# EAGLE board permamote (EAGLE 8.4.3)
REV: B
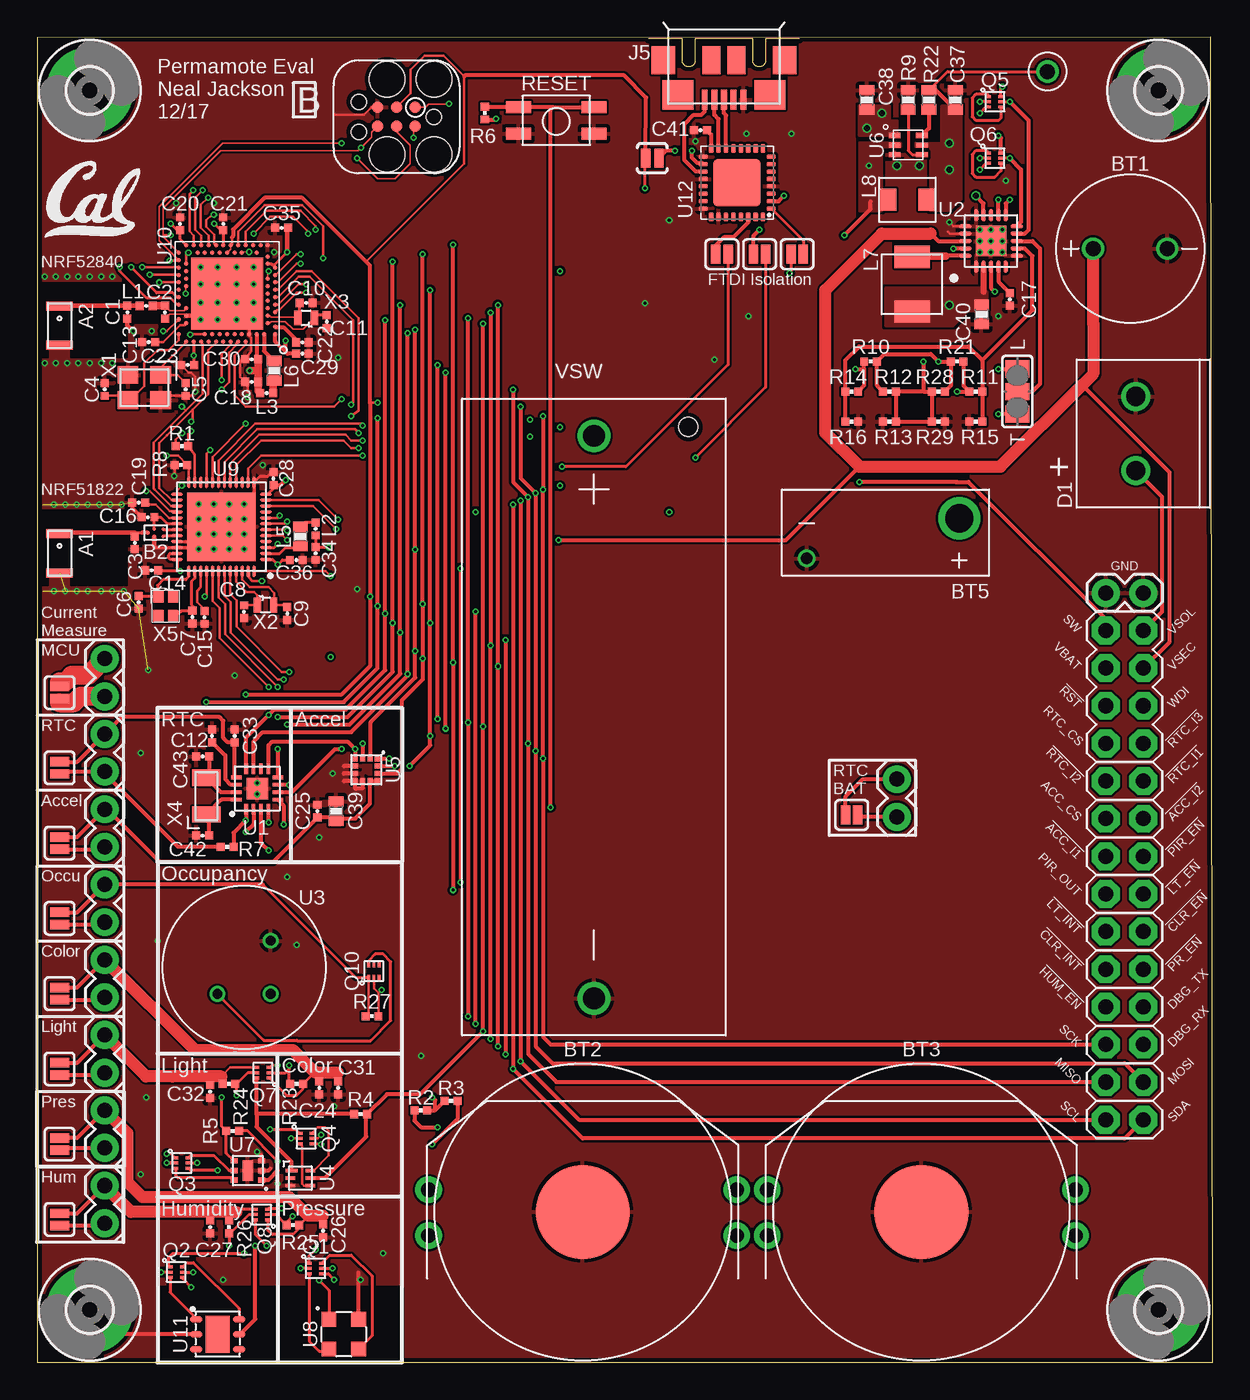
[diagram p5: board, top side]
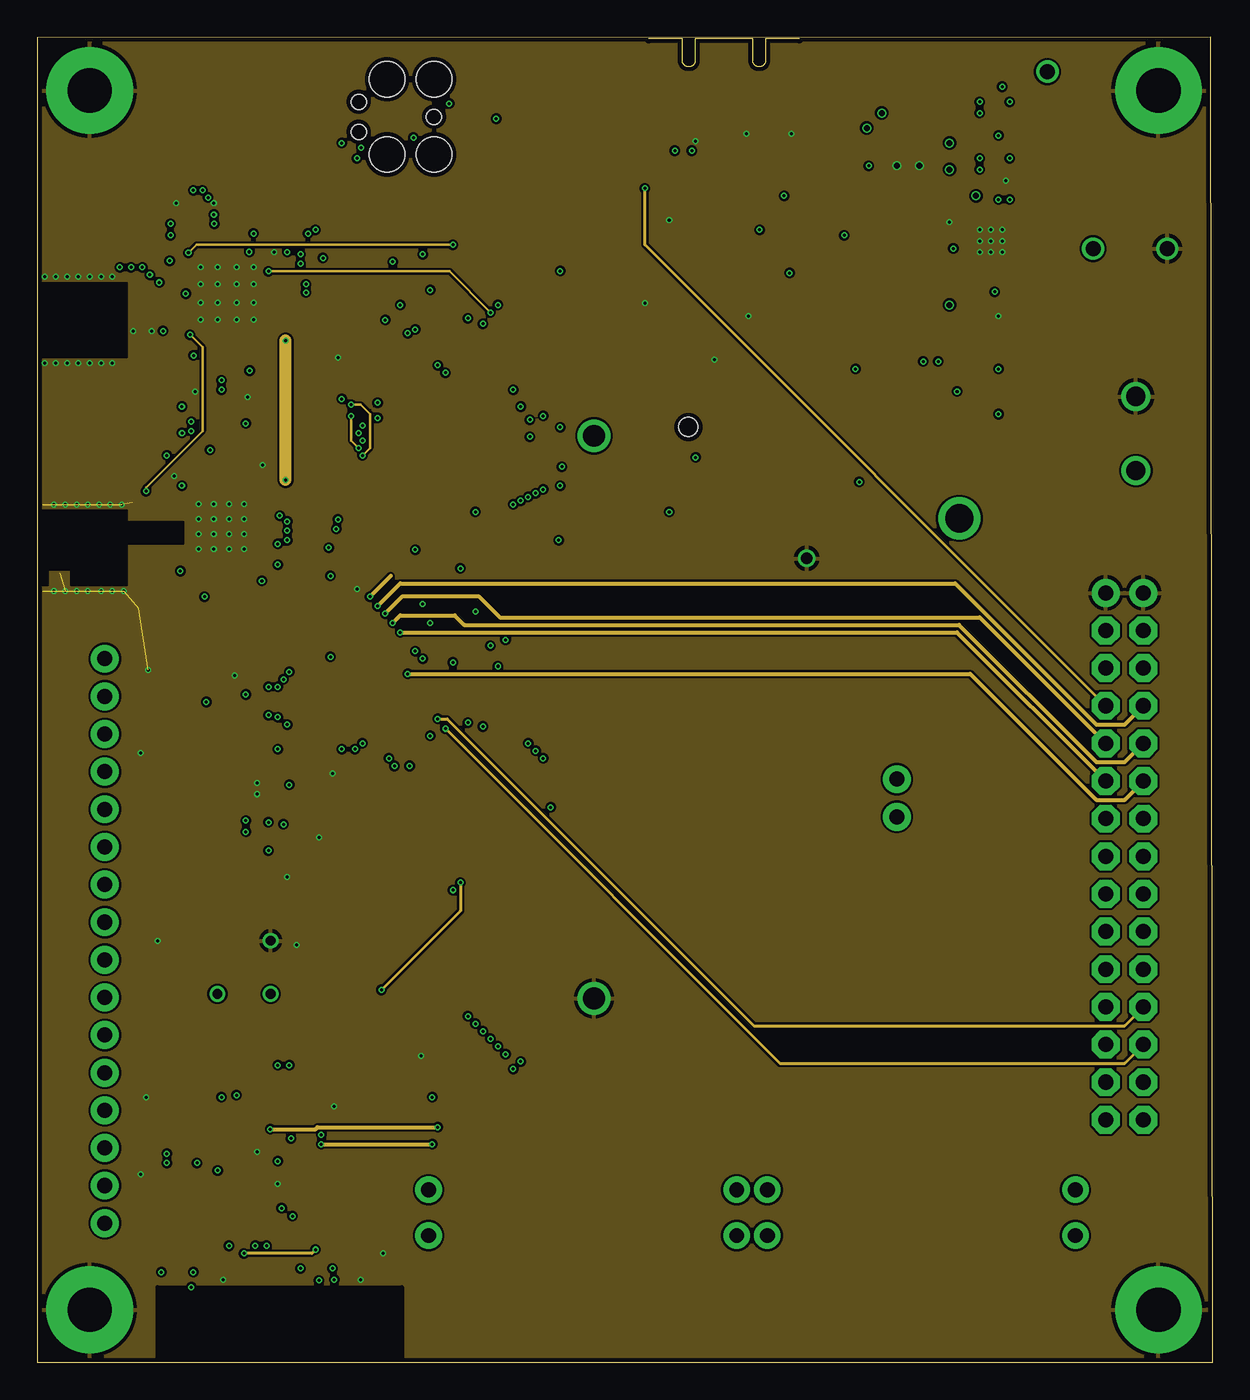
[diagram p6: board, inner layer Route2]
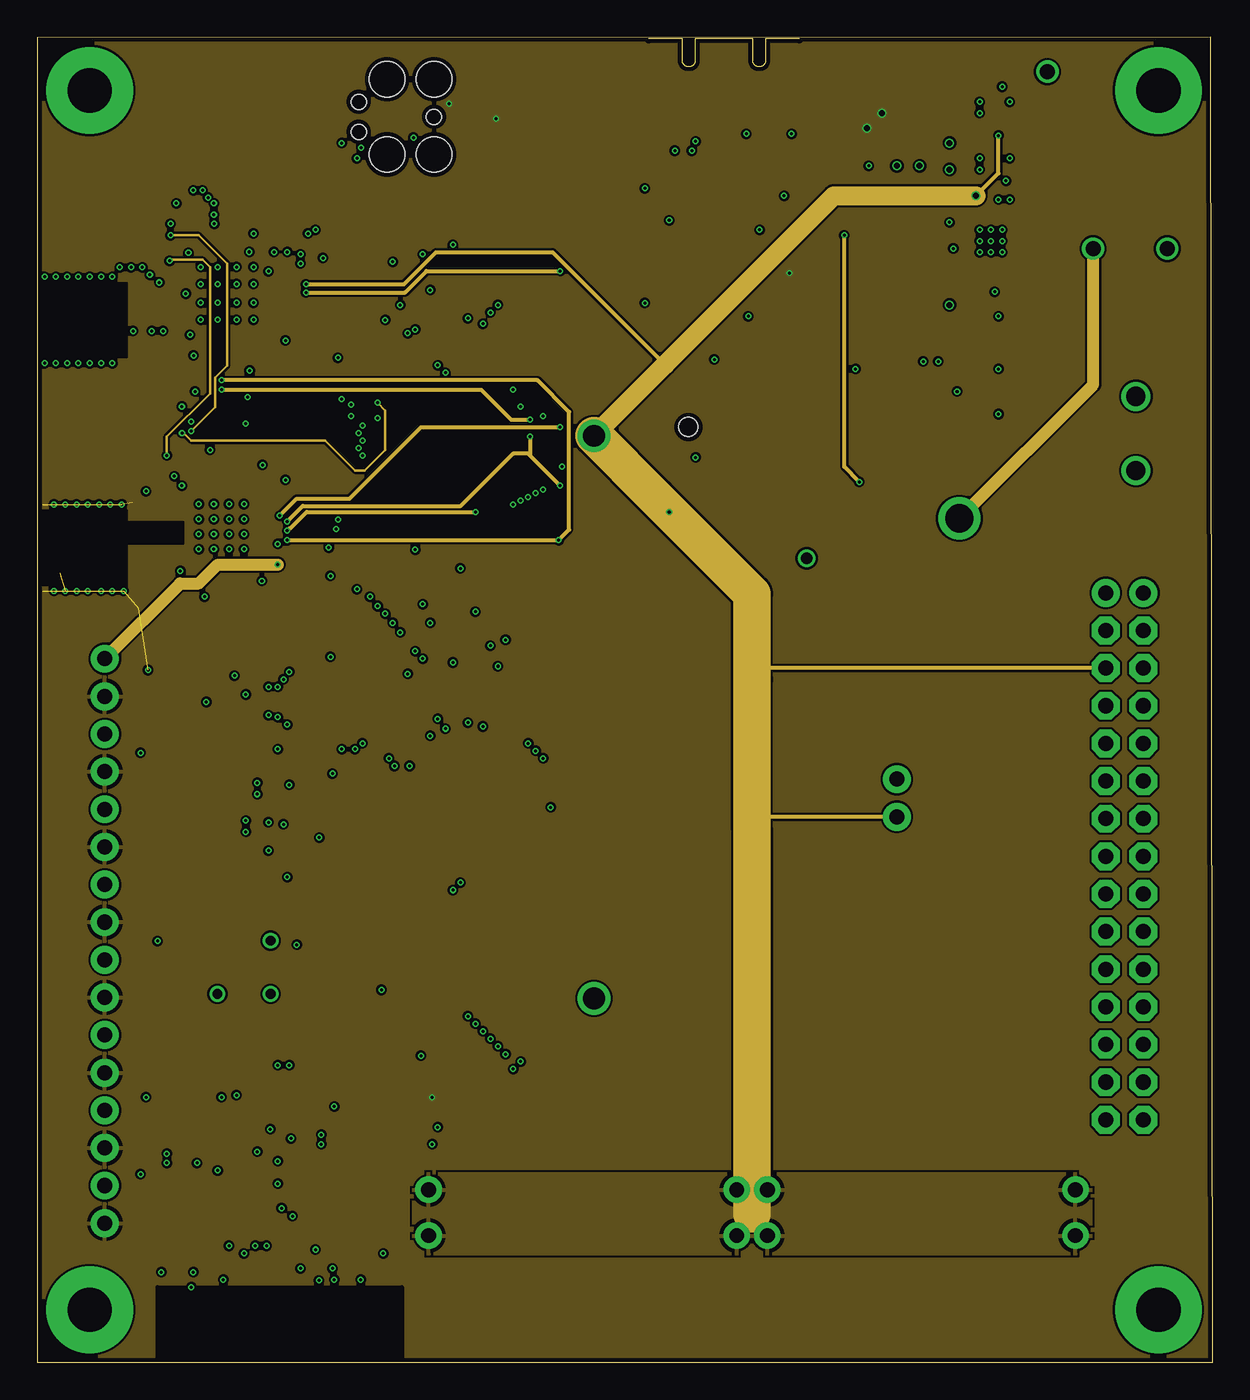
[diagram p7: board, inner layer Route15]
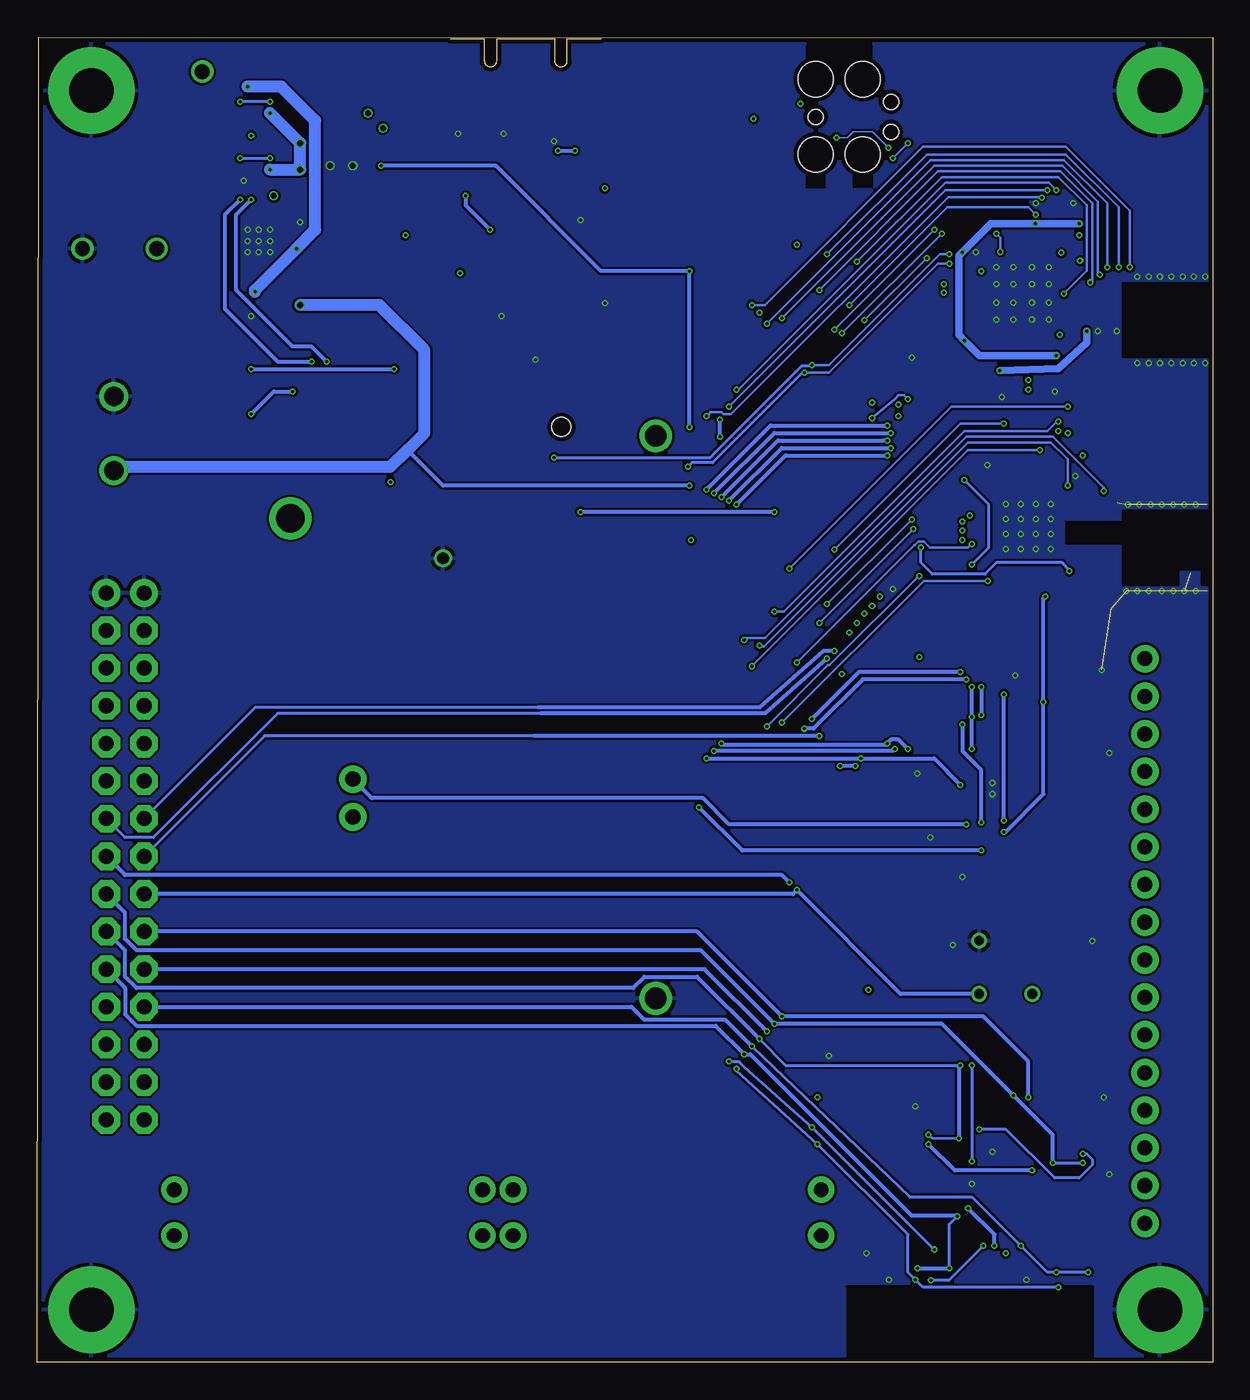
[diagram p8: board, bottom side, seen from below]

Size 79.36 x 89.46 mm. Coordinates in mm from the lower left corner, seen from the top.
Outline: 0,0 79.36,0 79.23,89.46 0,89.41 0,0
Copper layers (1+2*15+16): Top 0.0178mm / dielectric 59mil / Route2 0.0356mm / dielectric 0.1499mm / Route15 0.0356mm / dielectric 0.2007mm / Bottom 0.0178mm
Design rules "quickturn_co_kr_1oz_4lyr *": minimum track width 4mil, minimum drill 8mil, track to track 6mil, track to pad 6mil, pad to pad 6mil, via to via 6mil, smd to smd 6mil, copper to edge 12mil, drill to drill 12mil, minimum pad ring 8mil, minimum via ring 4mil, stop-mask expansion 3mil, vias tented up to drill 50mil, thermal gap 10mil

## Footprints (pad centres in the part's own frame; a part is rotated, then mirrored left to right if it is on the bottom)
ANT3216A063R2400A = smd 0.6 x 1.8: S1 -1.325,0; S2 1.325,0
BAL-NRF01D3 = smd 0.22 x 0.22: ANT1 -0.517,-0.25; ANT2 -0.517,0.25; GND 0.083,0.25; SE 0.516,0; VCC 0.083,-0.25
1020 = drill 1: + -2.5,0; - 2.5,0
BAT-HLD-002-THM = smd 6.35 x 6.35: GND 0,0 | drill 1 pad 1.8: POS1 -10.4,1.5; POS2 -10.4,-1.6; POS3 10.4,1.5; POS4 10.4,-1.6
BH123A = drill 1.47: + 18.985,0; - -18.985,0 | hole 1.27: 19.58,-6.37
VL-2020 = drill 1.9: + -5.1,-1.35 | drill 0.8: - 5.2,1.35
0402_CAP = smd 0.536 x 0.546: 1 -0.433,0; 2 0.433,0
0603_CAP = smd 0.7 x 1: 1 -0.65,0; 2 0.65,0
PHEONIX-1935161 = drill 1.3: 1 0,0; 2 5,0
3,0-PAD = drill 3 pad 5.842: B3,0 0,0
TC2030-IDC = smd 0.787 x 0.787: 1 -1.27,-0.635; 2 -1.27,0.635; 3 0,-0.635; 4 0,0.635; 5 1.27,-0.635; 6 1.27,0.635 | hole 2.375: -2.54,2.54; 0.635,2.54; 0.635,-2.54; -2.54,-2.54 | hole 1.016: -2.54,0; 2.54,1.016; 2.54,-1.016
2X10 = drill 1.016 pad 1.88 octagon: 1 -11.43,-1.27; 2 -11.43,1.27; 3 -8.89,-1.27; 4 -8.89,1.27; 5 -6.35,-1.27; 6 -6.35,1.27; 7 -3.81,-1.27; 8 -3.81,1.27; 9 -1.27,-1.27; 10 -1.27,1.27; 11 1.27,-1.27; 12 1.27,1.27; 13 3.81,-1.27; 14 3.81,1.27; 15 6.35,-1.27; 16 6.35,1.27; 17 8.89,-1.27; 18 8.89,1.27; 19 11.43,-1.27; 20 11.43,1.27
2X4 = drill 1.016 pad 1.88 octagon: 1 -3.81,-1.27; 2 -3.81,1.27; 3 -1.27,-1.27; 4 -1.27,1.27; 5 1.27,-1.27; 6 1.27,1.27; 7 3.81,-1.27; 8 3.81,1.27
1X02 = drill 1.016 pad 1.88: 1 0,0; 2 2.54,0
USB_MICRO_B-HIROSE-ZX62R-B-5P = smd 0.4 x 1.35: 1 1.3,4.125; 2 0.65,4.125; 3 0,4.125; 4 -0.65,4.125; 5 -1.3,4.125 | smd 2.1 x 2: P$1 3.1,3.8; P$2 -3.1,3.8 | smd 1.6 x 1.9: P$3 -4.1,1.45; P$6 4.1,1.45 | smd 1.2 x 1.9: P$4 -0.85,1.45; P$5 0.85,1.45
SJ_2S = smd 0.635 x 1.27: 1 -0.412,0; 2 0.412,0
SJ_2S-NO = smd 0.635 x 1.27: 1 -0.45,0; 2 0.45,0
74437324220 = smd 1.5 x 2.4: P$1 1.85,0; P$2 -1.85,0
IHL-1212BZ-11 = smd 1.2 x 1.5: P$1 -1.35,0; P$2 1.35,0
XDFN-6 = smd 0.35 x 0.2: 1 -0.425,0.35; 2 -0.425,0; 3 -0.425,-0.35; 4 0.425,-0.35; 5 0.425,0; 6 0.425,0.35
0402_RES = smd 0.536 x 0.546: 1 -0.433,0; 2 0.433,0
0603-RES = smd 0.7 x 1: 1 -0.65,0; 2 0.65,0
EVQP2 = smd 1.676 x 0.813: P$1 -2.54,-0.87; P$2 -2.54,0.908; P$3 2.54,-0.87; P$4 2.54,0.908
SJ_2 = smd 1.168 x 1.6: 1 -1.524,0; 2 0,0; 3 1.524,0
TESTPOINT_0.040IN = drill 1.016: TESTPOINT 0,0
QFN-16-3MM = smd 0.7 x 0.25: 1 -1.4,0.75; 2 -1.4,0.25; 3 -1.4,-0.25; 4 -1.4,-0.75; 9 1.35,-0.75; 10 1.35,-0.25; 11 1.35,0.25; 12 1.35,0.75 | smd 0.25 x 0.7: 5 -0.75,-1.4; 6 -0.25,-1.4; 7 0.25,-1.4; 8 0.75,-1.4; 13 0.75,1.4; 14 0.25,1.4; 15 -0.25,1.4; 16 -0.75,1.4 | smd 1.45 x 1.45: GND 0,0
S-PVQFN-N20-RGR = smd 0.28 x 0.85: 1 -1,-1.74; 2 -0.5,-1.74; 3 0,-1.74; 4 0.5,-1.74; 5 1,-1.74; 11 1,1.74; 12 0.5,1.74; 13 0,1.74; 14 -0.5,1.74; 15 -1,1.74 | smd 0.85 x 0.28: 6 1.74,-1; 7 1.74,-0.5; 8 1.74,0; 9 1.74,0.5; 10 1.74,1; 16 -1.74,1; 17 -1.74,0.5; 18 -1.74,0; 19 -1.74,-0.5; 20 -1.74,-1 | smd 2.05 x 2.05: PAD 0,0
AMN2 = drill 0.65: GND 1.796,-1.796; OUT -1.796,-1.796; VCC -1.796,1.796
ODFN-6-1.5MMX1.6MM = smd 0.8 x 0.25: 1 -0.6,0.5 | smd 0.65 x 0.25: 2 -0.675,0; 3 -0.675,-0.5; 4 0.675,-0.5; 5 0.675,0; 6 0.675,0.5
LGA-12 = smd 0.375 x 0.35: 1 -0.75,0.75; 2 -0.75,0.25; 3 -0.75,-0.25; 4 -0.75,-0.75; 7 0.75,-0.75; 8 0.75,-0.25; 9 0.75,0.25; 10 0.75,0.75 | smd 0.35 x 0.375: 5 -0.25,-0.75; 6 0.25,-0.75; 11 0.25,0.75; 12 -0.25,0.75
UDFN-6-MAXIM = smd 0.8 x 0.35: 1 -0.915,0.65; 2 -0.915,0; 3 -0.915,-0.65; 4 0.915,-0.65; 5 0.915,0; 6 0.915,0.65
UDFN-6-EXPOSED = smd 0.48 x 0.36: 1 -0.925,0.65; 2 -0.925,0; 3 -0.925,-0.65; 4 0.925,-0.65; 5 0.925,0; 6 0.925,0.65 | smd 0.71 x 1.4: EP 0,0
4-SMD = smd 1 x 1: 1 -1,1; 2 -1,-1; 3 1,-1; 4 1,1
QFN-48-6MM = smd 0.8 x 0.203: 1 -3,2.2; 2 -3,1.8; 3 -3,1.4; 4 -3,1; 5 -3,0.6; 6 -3,0.2; 7 -3,-0.2; 8 -3,-0.6; 9 -3,-1; 10 -3,-1.4; 11 -3,-1.8; 12 -3,-2.2; 25 3,-2.2; 26 3,-1.8; 27 3,-1.4; 28 3,-1; 29 3,-0.6; 30 3,-0.2; 31 3,0.2; 32 3,0.6; 33 3,1; 34 3,1.4; 35 3,1.8; 36 3,2.2 | smd 0.203 x 0.8: 13 -2.2,-3; 14 -1.8,-3; 15 -1.4,-3; 16 -1,-3; 17 -0.6,-3; 18 -0.2,-3; 19 0.2,-3; 20 0.6,-3; 21 1,-3; 22 1.4,-3; 23 1.8,-3; 24 2.2,-3; 37 2.2,3; 38 1.8,3; 39 1.4,3; 40 1,3; 41 0.6,3; 42 0.2,3; 43 -0.2,3; 44 -0.6,3; 45 -1,3; 46 -1.4,3; 47 -1.8,3; 48 -2.2,3 | smd 4.6 x 4.6: GND 0,0
AQFN73 = smd 0.3 x 0.3: A8 -1.25,3.25; A10 -0.75,3.25; A12 -0.25,3.25; A14 0.25,3.25; A16 0.75,3.25; A18 1.25,3.25; A20 1.75,3.25; A22 2.25,3.25; A23 2.75,3.25; AA24 3.25,-2.25; AB2 -2.75,-2.5; AC5 -2,-2.75; AC9 -1,-2.75; AC11 -0.5,-2.75; AC13 0,-2.75; AC15 0.5,-2.75; AC17 1,-2.75; AC19 1.5,-2.75; AC21 2,-2.75; AC24 3.25,-2.75; AD2 -2.75,-3.25; AD4 -2.25,-3.25; AD6 -1.75,-3.25; AD8 -1.25,-3.25; AD10 -0.75,-3.25; AD12 -0.25,-3.25; AD14 0.25,-3.25; AD16 0.75,-3.25; AD18 1.25,-3.25; AD20 1.75,-3.25; AD22 2.25,-3.25; AD23 2.75,-3.25; B1 -3.25,2.75; B3 -2.5,2.75; B5 -2,2.75; B7 -1.5,2.75; B9 -1,2.75; B11 -0.5,2.75; B13 0,2.75; B15 0.5,2.75; B17 1,2.75; B19 1.5,2.75; B24 3.25,2.75; C1 -3.25,2.25; D2 -2.75,2; D23 2.75,2; E24 3.25,1.75; F2 -2.75,1.5; F23 2.75,1.5; G1 -3.25,1.25; H2 -2.75,1; H23 2.75,1; J1 -3.25,0.75; J24 3.25,0.75; K2 -2.75,0.5; L1 -3.25,0.25; L24 3.25,0.25; M2 -2.75,0; N1 -3.25,-0.25; N24 3.25,-0.25; P2 -2.75,-0.5; P23 2.75,-0.5; R1 -3.25,-0.75; R24 3.25,-0.75; T2 -2.75,-1; T23 2.75,-1; U1 -3.25,-1.25; U24 3.25,-1.25; V23 2.75,-1.5; W1 -3.25,-1.75; W24 3.25,-1.75; Y2 -2.75,-2; Y23 2.75,-2 | smd 4.85 x 4.85: GND 0,0
DFN-6/3MM = smd 0.85 x 0.45: 1 -1.45,1; 2 -1.45,0; 3 -1.45,-1; 4 1.45,-1; 5 1.45,0; 6 1.45,1 | smd 1.6 x 2.5: P$1 0,0
QFN32 = smd 0.6 x 0.3: 1 -2.3,1.75; 2 -2.3,1.25; 3 -2.3,0.75; 4 -2.3,0.25; 5 -2.3,-0.25; 6 -2.3,-0.75; 7 -2.3,-1.25; 8 -2.3,-1.75; 17 2.3,-1.75; 18 2.3,-1.25; 19 2.3,-0.75; 20 2.3,-0.25; 21 2.3,0.25; 22 2.3,0.75; 23 2.3,1.25; 24 2.3,1.75 | smd 0.3 x 0.6: 9 -1.75,-2.3; 10 -1.25,-2.3; 11 -0.75,-2.3; 12 -0.25,-2.3; 13 0.25,-2.3; 14 0.75,-2.3; 15 1.25,-2.3; 16 1.75,-2.3; 25 1.75,2.3; 26 1.25,2.3; 27 0.75,2.3; 28 0.25,2.3; 29 -0.25,2.3; 30 -0.75,2.3; 31 -1.25,2.3; 32 -1.75,2.3 | smd 3.2 x 3.2: EXP 0,0
TXC-7V = smd 1.4 x 1.2: 1 -1.1,-0.85; 2 1.1,-0.85; 3 1.1,0.85; 4 -1.1,0.85
ABS05 = smd 0.5 x 1: A -0.55,0; B 0.55,0
2-SMD = smd 1.092 x 1.905: 1 -1.245,0; 2 1.245,0
TXC-8Y = smd 0.8 x 0.7: 1 -0.65,-0.5; 2 0.65,-0.5; 3 0.65,0.5; 4 -0.65,0.5

## Placement (x,y rotation side)
A1  ANT3216A063R2400A  [ANT3216A063R2400A]  1.52,54.61 270 top
A2  ANT3216A063R2400A  [ANT3216A063R2400A]  1.52,69.98 270 top
B2  BAL-NRF01D3  [BAL-NRF01D3]  8,56.01 180 top
BT1  LTOHTC1020  [1020]  73.79,75.18 0 top
BT2  BAT-HLD-002-THM  [BAT-HLD-002-THM]  36.83,10.16 0 top
BT3  BAT-HLD-002-THM  [BAT-HLD-002-THM]  59.69,10.16 0 top
BT4  BAT_PACKCR123A  [BH123A]  37.59,43.56 90 top
BT5  VL-2020  [VL-2020]  57.15,55.63 180 top
C1  0.5pF  [0402_CAP]  6.1,70.88 270 top
C2  0.8pF  [0402_CAP]  8.64,70.88 270 top
C3  0.8pF  [0402_CAP]  6.6,55.32 270 top
C4  12pF  [0402_CAP]  4.57,65.67 270 top
C5  12pF  [0402_CAP]  10.03,65.67 90 top
C6  12pF  [0402_CAP]  6.86,51.31 270 top
C7  12pF  [0402_CAP]  10.49,50.32 270 top
C8  12pF  [0402_CAP]  13.97,50.67 270 top
C9  12pF  [0402_CAP]  16.89,50.55 270 top
C10  12pF  [0402_CAP]  18.16,71.52 180 top
C11  12pF  [0402_CAP]  19.56,70.25 90 top
C12  47pF  [0402_CAP]  11.81,42.29 90 top
C13  100pF  [0402_CAP]  7.54,68.86 180 top
C14  1nF  [0402_CAP]  7.75,53.47 180 top
C15  1nF  [0402_CAP]  11.3,50.29 270 top
C16  2.2nF  [0402_CAP]  7.49,57.05 180 top
C17  10nF  [0402_CAP]  65.66,71.75 270 top
C18  47nF  [0402_CAP]  14.48,66.18 180 top
C19  47nF  [0402_CAP]  6.86,58.04 180 top
C20  0.1uF  [0402_CAP]  9.65,76.85 90 top
C21  0.1uF  [0402_CAP]  12.57,76.85 90 top
C22  0.1uF  [0402_CAP]  17.91,68.85 0 top
C23  0.1uF  [0402_CAP]  10.16,67.33 180 top
C24  0.1uF  [0402_CAP]  19.05,18.54 270 top
C25  0.1uF  [0402_CAP]  18.92,37.21 90 top
C26  0.1uF  [0402_CAP]  19.3,8.89 270 top
C27  0.1uF  [0402_CAP]  11.68,9.14 270 top
C28  0.1uF  [0402_CAP]  15.96,59.66 90 top
C29  1uF  [0402_CAP]  17.91,68.09 0 top
C30  1uF  [0402_CAP]  14.48,67.71 180 top
C31  1uF  [0402_CAP]  20.32,18.54 270 top
C32  1uF  [0402_CAP]  11.68,18.29 270 top
C33  1uF  [0402_CAP]  13.34,42.29 90 top
C34  1uF  [0402_CAP]  18.8,54.61 270 top
C35  4.7uF  [0402_CAP]  16.51,76.58 180 top
C36  4.7uF  [0402_CAP]  17.5,54.17 0 top
C37  10uF  [0603_CAP]  61.98,85.22 90 top
C38  10uF  [0603_CAP]  56.01,85.22 90 top
C39  10uF  [0603_CAP]  20.19,37.21 90 top
C40  4.7uF  [0603_CAP]  63.75,70.74 270 top
C41  0.1uF  [0402_CAP]  44.78,83.17 180 top
C42  DNP  [0402_CAP]  11.18,35.56 180 top
C43  DNP  [0402_CAP]  11.18,40.89 180 top
D1  SOLARCELLSCREW  [PHEONIX-1935161]  74.17,60.2 90 top
H1  MOUNT-PAD-ROUND3.0  [3,0-PAD]  75.69,3.56 0 top
H2  MOUNT-PAD-ROUND3.0  [3,0-PAD]  3.56,85.85 0 top
H3  MOUNT-PAD-ROUND3.0  [3,0-PAD]  75.69,85.85 0 top
H4  MOUNT-PAD-ROUND3.0  [3,0-PAD]  3.56,3.56 0 top
J1  TC2030-JLINK-L  [TC2030-IDC]  24.26,84.07 180 top
J2  M10X2  [2X10]  73.41,27.81 90 top
J3  M04X2  [2X4]  73.41,45.59 90 top
J4  [1X02]  72.14,51.94 0 top
J5  MICRO_USB_B_HIROSE_ZX62R-B-5P  [USB_MICRO_B-HIROSE-ZX62R-B-5P]  46.37,89.34 180 top
JP1  [SJ_2S]  1.52,35.05 270 top
JP2  [SJ_2S]  1.52,24.89 270 top
JP3  [SJ_2S]  1.52,19.81 270 top
JP4  [SJ_2S]  1.52,14.73 270 top
JP5  [SJ_2S]  1.52,9.65 270 top
JP6  [SJ_2S]  1.52,40.13 270 top
JP7  [SJ_2S]  1.52,45.21 270 top
JP8  [SJ_2S]  1.52,29.97 270 top
JP9  [1X02]  4.57,47.5 270 top
JP10  [1X02]  4.57,42.42 270 top
JP11  [1X02]  4.57,37.34 270 top
JP12  [1X02]  4.57,27.18 270 top
JP13  [1X02]  4.57,22.1 270 top
JP14  [1X02]  4.57,32.26 270 top
JP15  [1X02]  4.57,17.02 270 top
JP16  [1X02]  4.57,11.94 270 top
JP17  [SJ_2S-NO]  41.53,81.28 180 top
JP18  [SJ_2S]  54.99,36.96 0 top
JP19  [1X02]  58.04,39.37 270 top
JP20  [SJ_2S]  46.23,74.8 0 top
JP21  [SJ_2S]  48.77,74.8 0 top
JP22  [SJ_2S]  51.31,74.8 0 top
L1  3.3nH  [0402_CAP]  7.37,71.31 0 top
L2  15nH  [0402_CAP]  18.8,56.26 90 top
L3  15nH  [0402_CAP]  15.49,65.42 0 top
L5  10uH  [0603_CAP]  17.78,55.75 270 top
L6  10uH  [0603_CAP]  16,66.94 90 top
L7  22uH  [74437324220]  59.05,72.77 90 top
L8  1uH  [IHL-1212BZ-11]  58.75,78.47 180 top
Q1  PMDXB950UPEL  [XDFN-6]  18.8,6.35 0 top
Q2  PMDXB950UPEL  [XDFN-6]  9.4,6.1 0 top
Q3  PMDXB950UPEL  [XDFN-6]  9.78,13.46 0 top
Q4  PMDXB950UPEL  [XDFN-6]  18.16,15.11 0 top
Q5  PMDXB950UPEL  [XDFN-6]  64.64,85.09 0 top
Q6  PMDXB950UPEL  [XDFN-6]  64.64,81.28 0 top
Q7  PMDXB950UPEL  [XDFN-6]  15.24,19.56 180 top
Q8  PMDXB950UPEL  [XDFN-6]  15.16,9.99 180 top
Q10  PMDXB950UPEL  [XDFN-6]  22.73,26.41 90 top
R1  150Ω  [0402_RES]  9.78,61.85 0 top
R2  10kΩ  [0402_RES]  25.91,17.02 0 top
R3  10kΩ  [0402_RES]  27.94,17.65 180 top
R4  10kΩ  [0402_RES]  21.84,16.76 180 top
R5  10kΩ  [0402_RES]  13.21,15.62 0 top
R6  10kΩ  [0402_RES]  30.23,84.33 270 top
R7  10kΩ  [0402_RES]  12.83,34.8 180 top
R8  12kΩ  [0402_RES]  9.72,60.58 180 top
R9  80.6kΩ  [0603-RES]  58.8,85.22 270 top
R10  6.04k  [0402_RES]  56.26,67.56 180 top
R11  3.9M  [0402_RES]  63.37,65.53 180 top
R12  8.87M  [0402_RES]  57.53,65.53 180 top
R13  4.22M  [0402_RES]  57.53,63.5 0 top
R14  7.32M  [0402_RES]  54.99,65.53 0 top
R15  9.09M  [0402_RES]  63.37,63.5 0 top
R16  5.62M  [0402_RES]  54.99,63.5 180 top
R21  6.04k  [0402_RES]  62.1,67.56 0 top
R22  33MΩ  [0603-RES]  60.2,85.22 90 top
R23  100MΩ  [0402_RES]  17.53,18.8 0 top
R24  100MΩ  [0402_RES]  12.95,18.8 180 top
R25  100MΩ  [0402_RES]  17.27,9.27 0 top
R26  100MΩ  [0402_RES]  12.95,9.14 90 top
R27  100MΩ  [0402_RES]  22.61,23.37 180 top
R28  6.19M  [0402_RES]  60.83,65.53 0 top
R29  6.81M  [0402_RES]  60.83,63.5 180 top
S1  EVQP2  [EVQP2]  35.05,83.82 0 top
SJ1  [SJ_2]  66.17,65.53 270 top
TP10  TEST_POINT_0.040IN  [TESTPOINT_0.040IN]  68.2,87.12 180 top
U1  AB1815-T3  [QFN-16-3MM]  14.86,38.73 90 top
U2  BQ25505  [S-PVQFN-N20-RGR]  64.39,75.69 0 top
U3  EKMB1101111  [AMN2]  13.97,26.67 90 top
U4  ISL29125  [ODFN-6-1.5MMX1.6MM]  17.78,12.45 0 top
U5  LIS2DW12  [LGA-12]  22.23,40.01 270 top
U6  MAX17222  [UDFN-6-MAXIM]  58.8,82.17 0 top
U7  MAX44009  [UDFN-6-EXPOSED]  14.22,12.95 180 top
U8  MS5637-02BA03  [4-SMD]  20.7,1.91 0 top
U9  NRF51822QF  [QFN-48-6MM]  12.45,56.41 180 top
U10  NRF52840  [AQFN73]  12.83,72.15 180 top
U11  SI7021-A20-GM1  [DFN-6/3MM]  12.19,1.91 0 top
U12  FT232RQ  [QFN32]  47.26,79.63 180 top
U$1  [UCB_CAL_200MIL]  0.51,75.95 0 top
X1  32MHz  [TXC-7V]  7.24,65.8 180 top
X2  ABS05-32.768KHZ-9-T  [ABS05]  15.42,51.13 0 top
X3  32.768kHz  [ABS05]  18.16,70.5 180 top
X4  ABS07-32.768KHZ-7-T  [2-SMD]  11.43,38.23 90 top
X5  16MHz  [TXC-8Y]  8.69,51.03 270 top

## Tracks (layer width: path | path; a pad name or v marks a point on that pad's centre or on a via)
3V3OUT
  Top 0.254: C41.1 45.51,82.87 U12.16
!CLR_EN  (via drill 0.2)
  Top 0.102: U10.T2 15.58,73.62 v15.62,73.65
  Top 0.152: v9.78,59.18 9.45,58.85 U9.25 | Q4.5 18.92,15.11 v19.18,15.37 | Q4.2 v17.14,15.11
  Top 0.203: Q7.2 16.76,19.56 17.02,19.81 v17.02,20.07 17.02,18.87 R23.1
  Top 0.254: v30.61,21.84 v30.61,48.39 v30.61,70.87
  Route2 0.152: v30.61,70.87 27.85,73.65 v15.62,73.65
  Bottom 0.152: v9.78,59.18 9.78,60.96 10.92,62.1 16.51,62.1 30.29,48.32 30.54,48.32 v30.61,48.39 | v19.18,15.37 18.92,15.11 v17.14,15.11
  Bottom 0.203: v17.02,20.07 28.83,20.07 v30.61,21.84
  Bottom 0.254: v17.02,20.07 17.14,19.94 v17.14,15.11 | J2.11 73.41,27.81 73.41,26.04 72.64,25.27 39.12,25.27 38.35,26.04 34.8,26.04 v30.61,21.84
!CLR_INT  (via drill 0.2)
  Top 0.152: U10.W24 9.55,73.93 9.53,73.91 v7.11,73.91 | v19.81,53.09 19.49,53.41 U9.48
  Top 0.254: v30.1,70.1 v30.1,42.93 v30.1,22.35 25.86,18.11 23.62,18.11 R4.1 22.23,16.71 22.23,15.24 19.43,12.45 U4.5
  Bottom 0.152: v7.11,73.91 7.11,78.23 10.03,81.15 19.05,81.15 v30.1,70.1 | v30.1,42.93 25.96,47.07 25.86,47.07 19.84,53.09 v19.81,53.09
  Bottom 0.254: v30.1,22.35 34.29,26.54 J2.10
!HUM_EN  (via drill 0.2)
  Top 0.152: U9.21 11.45,61.36 v11.68,61.59
  Top 0.203: Q2.5 v10.54,6.1 | Q2.2 v8.38,6.1 | Q8.5 14.31,9.99 13.03,8.71 R26.1 v12.95,7.87 | U10.J24 9.45,71.4 9.01,71.84 7.41,71.84 5.59,73.66 v5.59,73.91
  Top 0.254: v31.11,21.34 v31.11,46.99 v31.11,71.37
  Bottom 0.152: v11.68,61.59 16.51,61.59 v31.11,46.99 | v5.59,73.91 5.59,77.72 9.91,82.04 19.56,82.04 29.78,71.82 | 29.78,71.82 30.1,71.5 | v31.11,71.37 30.23,71.37 29.78,71.82
  Bottom 0.203: v8.38,6.1 v10.54,6.1 11.18,6.1 v12.95,7.87 16.26,11.18 20.45,11.18 v31.11,21.34
  Bottom 0.254: J2.8 39.24,24 38.38,23.14 32.92,23.14 v31.11,21.34
!LT_EN  (via drill 0.2)
  Top 0.152: U9.26 9.08,58.21 8.26,59.03 8.26,62.05 8.76,62.56 | 10.5,64.3 8.76,62.56 | 10.5,64.3 11.56,65.36 11.56,68.33 12.08,68.85 U10.A16 | 10.5,64.3 10.5,63.59 v10.41,63.5 | 8.79,62.59 8.76,62.56 | 8.76,62.56
  Top 0.203: Q3.5 v10.79,13.46 | 9.07,13.46 v8.76,13.46 Q3.2 | Q7.5 14.22,19.56 13.46,18.8 | 13.46,18.8 R24.1 | v13.46,18.03 13.46,18.8
  Top 0.254: v29.59,22.86 v29.59,50.67
  Bottom 0.152: v10.41,63.5 10.49,63.42 10.59,63.42 11.15,62.87 16.76,62.87 28.96,50.67 v29.59,50.67
  Bottom 0.203: v10.79,13.46 v8.76,13.46
  Bottom 0.254: v10.79,13.46 10.79,15.37 v13.46,18.03 18.29,22.86 v29.59,22.86 34.54,27.81 72.64,27.81 73.41,28.57 73.41,30.35 J2.13
!LT_INT  (via drill 0.2)
  Top 0.152: U10.U24 9.56,73.42 9.54,73.41 v7.62,73.41 | U9.47 14.32,53.34 14.32,52.97 14.53,52.76 v15.18,52.76
  Top 0.203: U7.4 12.78,14.13 R5.1 12.45,15.95 v12.45,17.91
  Top 0.254: v29.08,23.37 v29.08,43.18 v29.08,70.48
  Bottom 0.152: v15.18,52.76 19.51,52.76 v29.08,43.18 | v7.62,73.41 7.75,73.53 7.75,78.36 10.16,80.77 18.8,80.77 v29.08,70.48 29.08,70.36
  Bottom 0.254: J2.12 34.8,29.08 v29.08,23.37 15.49,23.37 12.45,20.32 v12.45,17.91
!PIR_EN  (via drill 0.2)
  Top 0.152: U10.A20 11.08,68.82 11.18,68.72 11.18,65.41 10.03,64.26 | v9.78,64.52 10.03,64.26 | 10.03,64.26 7.87,62.1 7.87,58.98 7.95,58.9 9.04,57.81 U9.27 | 23.04,24.94 R27.1 | 23.04,24.94 v23.24,25.15 | Q10.2 22.73,25.25 23.04,24.94
  Top 0.254: v28.57,53.59 v28.57,32.38
  Route2 0.203: v28.57,32.38 28.57,30.48 v23.24,25.15
  Bottom 0.152: v28.57,53.59 17.65,64.52 v9.78,64.52
  Bottom 0.254: v28.57,32.38 29.08,32.89 73.41,32.89 J2.15
!PR_EN  (via drill 0.2)
  Top 0.152: U9.28 9.38,57.48 8.94,57.48 7.62,58.8 v7.37,58.8 | U10.B19 10.35,69.4 v10.32,69.37
  Top 0.203: Q1.5 v19.94,6.35 | Q1.2 v17.78,6.35 | Q8.2 16.12,9.99 16.74,9.37 | 16.74,9.37 R25.1 | v17.24,9.88 16.74,9.37
  Top 0.254: v31.62,48.77 v31.62,20.8
  Route2 0.152: v10.32,69.37 11.18,68.52 11.18,62.87 7.37,59.05 v7.37,58.8
  Bottom 0.152: v7.37,58.8 7.37,59.05 10.79,62.48 16.64,62.48 30.23,48.9 31.5,48.9 v31.62,48.77
  Bottom 0.203: v17.78,6.35 17.78,9.34 v17.24,9.88
  Bottom 0.254: v19.94,6.35 v17.78,6.35 | J2.9 73.41,25.27 73.41,23.5 72.64,22.73 33.55,22.73 v31.62,20.8 31.22,20.8 20.32,9.91 17.27,9.91 v17.24,9.88
!RST  (via drill 0.2)
  Top 0.102: U10.AC13 13.08,75.15 U10.AD12
  Top 0.152: R1.1 9.35,62.3 v9.78,62.74 | U10.AD12 13.16,75.48 13.16,75.95 | v22.99,64.77 22.48,64.77 | J1.3 25.23,85.68 25.23,87.26 26.15,88.18 27.45,88.18 28.83,86.8 28.83,80.9 22.23,74.3
  Top 0.203: v41.02,79.25 41.02,81.18 JP17.2
  Top 0.254: v14.1,45.09 20.57,45.09 22.48,46.99 v22.48,51.69 22.48,64.77 22.48,74.04 22.23,74.3 17.91,78.61 15.37,78.61 13.23,76.47 13.23,76.02 13.16,75.95 | R7.1 13.26,35.74 v14.1,36.58 v14.11,36.59 U1.1 | JP17.2 41.12,85.38 39.62,86.87 28.9,86.87 28.83,86.8
  Route2 0.203: v41.02,79.25 41.02,75.44 J3.4
  Route2 0.254: v22.48,51.69 23.88,53.09
  Route15 0.152: v9.78,62.74 9.91,62.74 10.41,62.23 19.43,62.23 21.46,60.2 22.1,60.2 23.5,61.59 23.5,64.26 v22.99,64.77
  Bottom 0.254: v14.1,36.58 v14.1,45.09
!RTC_EXTR  (via drill 0.2)
  Top 0.254: 34.8,84.73 S1.P$4 | 34.8,84.73 S1.P$2 32.48,84.76 R6.1 | U1.3 15.11,35.06 v15.62,34.54 | v34.67,37.47 34.67,84.6 34.8,84.73
  Bottom 0.254: v34.67,37.47 31.75,34.54 v15.62,34.54
!RTC_IRQ1  (via drill 0.2)
  Top 0.102: U10.AC9 13.88,74.96 v14.32,74.96
  Top 0.152: v18.29,76.2 18.29,76.33 17.27,77.34 15.75,77.34 v14.61,76.2
  Top 0.254: U1.11 14.61,41.91 15.24,42.55 21.21,42.55 25.02,46.35 v25.02,46.48 v25.02,69.47
  Route2 0.254: J2.19 73.41,37.97 71.5,37.97 62.99,46.48 v25.02,46.48
  Bottom 0.152: v18.29,76.2 v25.02,69.47 | v14.32,74.96 14.32,75.92 v14.61,76.2
!RTC_IRQ2  (via drill 0.2)
  Top 0.152: U10.AD16 11.96,75.52 11.96,76.12 11.43,76.65 11.43,77.09 11.81,77.47 v11.94,77.47
  Top 0.254: U1.4 v15.61,36.46 v15.62,36.45 | v16.89,43.05 21.08,43.05 24.51,46.48 v24.51,49.28 v24.51,71.37
  Route2 0.254: J2.20 62.1,49.28 v24.51,49.28
  Bottom 0.152: v11.94,77.47 12.45,77.98 17.91,77.98 v24.51,71.37
  Bottom 0.254: v15.62,36.45 15.62,40.01 16.89,41.27 v16.89,43.05
!RTC_IRQ3  (via drill 0.2)
  Top 0.102: U10.P23 10.05,72.62 v10.05,72.14
  Top 0.152: U9.42 12.25,51.63 12.7,51.18 12.7,49.15 v16.26,45.59
  Top 0.254: U1.8 16.26,41.27 v16.26,41.4 | v24,74.3 v24,49.91 24,46.61 20.95,43.56 v16.26,43.56
  Route2 0.254: v24,49.91 24.51,50.42 28.19,50.42 28.83,49.78 62.23,49.78 71.5,40.51 73.41,40.51 J3.1
  Bottom 0.152: v24,74.3 18.29,80.01 10.41,80.01 8.51,78.11 8.51,73.68 v10.05,72.14
  Bottom 0.254: v16.26,41.4 v16.26,43.56 v16.26,45.59
!VBAT_PRI_ON  (via drill 0.2)
  Top 0.203: v65.66,81.28 Q6.5 | Q6.2 v63.63,81.28
  Top 0.254: v65.66,81.28 66.42,80.52 66.42,76.98 U2.10
  Bottom 0.203: v65.66,81.28 v63.63,81.28
!VBAT_SEC_ON  (via drill 0.2)
  Top 0.203: Q5.2 v63.63,85.09 | Q5.5 v65.66,85.09
  Top 0.254: v65.66,85.09 66.93,83.82 66.93,76.45 66.67,76.19 U2.9
  Bottom 0.203: v63.63,85.09 v65.66,85.09
ACC_CS  (via drill 0.2)
  Top 0.152: U9.20 11.85,61.12 v14.1,63.37 | v18.8,76.45 18.8,76.71 17.78,77.72 15.49,77.72 14.08,76.31 U10.AD8
  Top 0.254: U5.2 22.52,40.8 22.52,43.22 25.53,46.23 v25.53,48.01 v25.53,54.86 v25.53,69.72
  Bottom 0.152: v14.1,63.37 17.02,63.37 v25.53,54.86 | v18.8,76.45 v25.53,69.72
  Bottom 0.203: 45.51,44.22 64.62,44.22 J2.18
  Bottom 0.254: v25.53,48.01 26.29,48.01 30.58,44.22 45.51,44.22
ACC_INT1  (via drill 0.2)
  Top 0.152: 9.56,72.91 U10.R24 8.51,72.9 v8.26,72.9 | U9.10 18.65,57.81 v20.19,56.26
  Top 0.254: v26.54,72.39 v26.54,49.91 v26.54,42.29 26.54,41.66 v25.15,40.26 | U5.12 v24.13,40.26
  Bottom 0.152: v20.19,56.26 v26.54,49.91 | v8.26,72.9 8.13,73.03 8.13,78.23 10.29,80.39 18.54,80.39 v26.54,72.39
  Bottom 0.203: 45.79,42.29 64.01,42.29 J2.16
  Bottom 0.254: v24.13,40.26 v25.15,40.26 | v26.54,42.29 45.79,42.29
ACC_INT2  (via drill 0.2)
  Top 0.152: U10.L24 | U9.11 19.01,58.21 v20.32,56.9
  Top 0.203: U10.L24 9.45,71.9 9.16,72.2 8.07,72.2 v6.35,73.91
  Top 0.254: U5.11 23.75,39.76 23.75,39.75 24.3,39.75 24.64,40.08 24.64,44.7 26.04,46.1 v26.04,47.5 v26.04,51.18 v26.04,74.8
  Bottom 0.152: v20.32,56.9 v26.04,51.18 | v6.35,73.91 6.35,77.98 9.91,81.53 19.3,81.53 v26.04,74.8
  Bottom 0.203: 45.34,43.81 63.12,43.81 71.5,35.43 73.41,35.43 J2.17
  Bottom 0.254: v26.04,47.5 30.23,43.81 45.34,43.81
AVDD1  (via drill 0.2)
  Top 0.203: U9.35 8.96,54.61 8.89,54.51 8.89,54.3 8.99,54.21 U9.36 9.45,53.65 v9.68,53.42 8.23,53.42 C14.1 | L2.1 C34.1 19.63,55.04 v19.68,54.99
  Bottom 0.203: v9.68,53.42 10.16,53.98 14.61,53.98 15.37,53.21 18.92,53.21 19.68,53.98 v19.68,54.99
D+
  Top 0.254: U12.14 46.51,84.18 46.35,84.33 46.35,85.21 J5.3
D-
  Top 0.254: U12.15 46.01,83.92 45.72,84.2 J5.2
DBG_RX  (via drill 0.2)
  Top 0.152: U10.R1 16.26,72.9 17.53,74.17 v17.78,74.17 | U9.43 12.65,51.74 13.08,51.31 13.08,49.28 16.26,46.1 v16.64,46.1
  Top 0.203: v35.43,60.45 39.75,60.45 46.64,67.34 JP20.2
  Top 0.254: v27.56,42.77 v27.56,66.8 | 46.55,74.71 JP20.2
  Route2 0.203: v27.56,42.77 50.14,20.19 73.41,20.19 J2.5
  Bottom 0.152: v17.78,74.17 18.54,74.17 25.91,66.8 v27.56,66.8
  Bottom 0.203: v27.56,66.8 27.69,66.8 33.76,60.73 35.15,60.73 v35.43,60.45
  Bottom 0.254: v16.64,46.1 23.62,46.1 26.95,42.77 v27.56,42.77
DBG_TX  (via drill 0.2)
  Top 0.152: v17.78,74.8 17.51,74.8 16.11,73.4 U10.U1 | U9.44 13.05,51.85 13.46,51.44 13.46,49.66 16.51,46.61 v17.02,46.61
  Top 0.203: JP21.2 49.18,65.82 v44.45,61.09
  Top 0.254: v27.05,43.43 v27.05,67.31
  Route2 0.203: v27.05,43.43 27.69,43.43 48.39,22.73 73.41,22.73 J2.7
  Bottom 0.152: v17.78,74.8 18.41,74.8 25.91,67.31 v27.05,67.31
  Bottom 0.203: v27.05,67.31 27.1,67.26 27.75,67.26 33.74,61.27 33.74,61.26 33.91,61.09 v44.45,61.09
  Bottom 0.254: v17.02,46.61 23.88,46.61 v27.05,43.43
DCC1
  Top 0.203: U9.2 16.38,54.61 16.76,54.99 17.41,54.99 L5.2
GND  (via drill 0.2, 0.41)  (20 unrouted)
  Top 0.102: 9.43,70.75 | 9.43,70.75 9.97,70.75 U10.F23 | C2.2 8.94,70.75 9.43,70.75
  Top 0.152: U10.B7 14.33,69.31 14.46,69.19 14.46,68.25 C30.2 13.72,67.63 13.72,66.51 C18.2 14.22,66 14.22,65.53 | 11.05,70.88 v11.05,71.52 11.68,72.15 U10.GND | C23.2 10.23,66.82 10.39,66.82 10.67,66.55 v10.67,65.53 10.38,65.24 C5.1 8.88,65.24 | 9.28,60.7 R8.2 9.28,59.95 v9.27,59.82 | J1.5 22.59,84.71 22.09,84.2 20.07,84.2 | U2.16 61.87,76.69 v61.59,76.96 | U2.17 61.6,76.19 61.47,76.33
  Top 0.203: U10.B7 14.33,70.65 U10.GND | C28.2 15.93,60.17 15.54,59.79 15.03,59.79 U9.13 14.65,58.74 v13.97,57.94 | U9.33 10.28,55.41 v10.92,54.89 10.68,55.01 U9.34 9.43,54.99 8,54.99 7.92,55.07 | v13.97,55.91 v13.97,54.89 | U9.GND v12.95,55.91 | 5.21,1.91 H4.B3,0
  Top 0.254: U11.2 5.21,1.91 | U8.4 21.7,6.06 | U5.6 20.7,39.76 20.7,39.75 | 20.7,39.24 21.46,39.24 U5.7 21.48,38.73 21.54,38.73 21.56,38.75 21.98,38.75 U5.8 | U5.5 20.7,40.26 | C19.2 6.42,57.68 C16.2 | U7.2 15.62,12.95 15.75,13.08 | U7.3 15.15,13.93 v14.86,14.22
  Top 0.305: B2.GND 7.92,55.07 | U10.F23 10.61,70.65 10.84,70.88 11.05,70.88 | 6.1,69.98 C1.2 6.1,69.99 v6.48,69.61
  other vias: 59.56,80.77 11.94,55.91 11.94,56.92 11.94,57.94 11.94,54.89 10.92,55.91 10.92,56.92 10.92,57.94 12.95,57.94 12.95,56.92 12.95,54.89 13.97,56.92 15.21,60.58 14.61,73.93 14.61,72.79 14.61,71.52 14.61,70.37 7.75,69.61 13.46,73.93 13.46,72.79 13.46,71.52 13.46,70.37 12.19,73.93 12.19,72.79 12.19,71.52 12.19,70.37 11.05,73.93 11.05,72.79 11.05,70.37 12.57,5.59 21.84,5.59 25.91,20.7 20.07,17.27 6.99,41.15 21.59,52.2 13.34,46.35 8.13,28.45 17.53,28.19 6.99,12.7 11.94,78.23 9.4,78.23 16,74.95 14.86,39.12 14.86,38.35 16.89,32.77 19.05,35.43 14.22,65.15 20.32,67.82 19.94,39.75 7.37,17.91 64.9,70.61 58.04,80.77 65.41,79.76 63.63,76.45 63.63,75.69 63.63,74.93 64.39,74.93 64.39,75.69 64.39,76.45 65.15,76.45 65.15,75.69 65.15,74.93 23.37,7.37 16.26,12.06 44.45,82.42 41.02,71.5 42.67,77.09 45.72,67.69 48.01,70.61 50.93,82.93 47.88,82.93 5.08,73.28 4.32,73.28 3.56,73.28 2.79,73.28 2.03,73.28 1.27,73.28 0.51,73.28 5.08,67.44 4.32,67.44 3.56,67.44 2.79,67.44 2.03,67.44 1.27,67.44 0.51,67.44 7.49,46.74 5.84,52.07 5.08,52.07 4.32,52.07 3.43,52.07 2.67,52.07 1.91,52.07 1.14,52.07 5.71,57.91 4.95,57.91 4.19,57.91 3.43,57.91 2.67,57.91 1.91,57.91 1.14,57.91
  pour Top (rank 2): 0,89.41 79.25,89.41 79.25,0 0,0
  pour Bottom (rank 2): 0,89.41 79.25,89.41 79.25,0 0,0
  pour Top (rank 2, no thermals): 0.76,68.83 2.29,68.83 2.29,67.56 0.76,67.56
  pour Top (rank 2, no thermals): 0.76,52.2 0.76,53.47 2.29,53.47 2.29,52.2
  pour Route2 (rank 2): 0,89.41 0,0 79.25,0 79.25,89.41
MISO  (via drill 0.2)
  Top 0.152: U10.AD22 10.58,76.05 10.29,76.34 10.29,78.87 v10.54,79.12 | U9.17 13.05,60.67 14.99,62.61 20.83,62.61 21.21,62.23 v21.97,62.23
  Top 0.254: U1.6 16.28,38.51 17.22,38.51 20.11,41.4 v20.57,41.4 | v32.13,65.66 32.13,59.44 v33.15,58.42 v33.15,41.78 33.15,20.83 35.05,18.92 J2.4 | v21.97,41.78 v21.98,41.78 U5.3
  Bottom 0.152: v10.54,79.12 11.05,79.63 18.03,79.63 32,65.66 v32.13,65.66 | 22.23,62.23 v21.97,62.23
  Bottom 0.254: v33.15,41.78 33.05,41.68 22.07,41.68 v21.97,41.78 21.72,42.04 21.21,42.04 v20.57,41.4 | 22,62.23 22.23,62.23 29.34,62.23 v33.15,58.42
MOSI  (via drill 0.2)
  Top 0.152: U10.AD20 11.08,76.06 10.67,76.47 10.67,78.61 v11.18,79.12 | U9.18 12.65,60.78 14.86,62.99 21.46,62.99 v21.72,62.74
  Top 0.254: U1.9 15.62,40.1 15.62,41.66 15.88,41.91 20.95,41.91 v21.46,41.4 21.48,41.39 U5.4 | v32.64,64.52 32.64,59.69 v33.66,58.67 v33.66,41.27 33.66,21.34 34.8,20.19 73.41,20.19 J2.3
  Bottom 0.152: v32.64,64.52 18.03,79.12 v11.18,79.12
  Bottom 0.254: v33.66,41.27 21.59,41.27 v21.46,41.4 | v21.72,62.74 29.59,62.74 v33.66,58.67
N$1  (via drill 0.2)
  Top 0.254: R21.2 62.54,65.94 R11.2 v62.1,65.53 | SJ1.3 v64.9,64.01
  Bottom 0.254: v64.9,64.01 63.37,65.53 v62.1,65.53
N$2
  Top 0.254: U10.C1 16.11,69.87 16.64,69.87 17.47,69.03 C22.1
N$3  (via drill 0.2)
  Top 0.152: U10.E24 9.55,70.4 8.76,69.61 v8.51,69.61
  Top 0.254: U10.B5 14.83,67.88 C30.1 | 14.91,65.57 L3.1
  Top 0.508: 14.91,66.94 C30.1 | 14.91,66.94 C18.1 14.91,65.57 | v14.35,66.94 14.91,66.94
  Bottom 0.508: v8.51,69.61 8.51,68.85 10.41,67.07 v14.35,66.94
N$4
  Top 0.152: C13.1 8.51,68.86 9.66,70.02 9.95,70.02 U10.D23
N$5
  Top 0.102: 10.11,71.14 U10.H23 9.93,71.01 9.32,71.01 | 9.32,71.01 | C2.1 8.94,71.01 9.32,71.01
  Top 0.508: C2.1 7.98,71.31 L1.2
N$6
  Top 0.305: 6.31,71.31 7.06,71.31 L1.1 | 6.31,71.31 C1.1 1.54,71.31 A2.S1 | 6.31,71.31
N$7
  cutout Route2: 0,67.82 6.1,67.82 6.1,72.9 0,72.9
N$8
  Top 0.152: C4.2 6.23,65.24 X1.3 6.35,65.02 | 6.35,65.02 6.39,65.03 | 6.35,65.02 7.24,65.9 7.24,67.44 8.13,68.33 8.89,68.33 9.58,69.01 U10.B24
N$9
  Top 0.152: C5.2 9.49,66.65 X1.1 8.38,66.69 8.38,67.18 10.08,68.88 U10.A23
N$10
  cutout Top: 62.87,76.71 62.87,76.45 62.48,76.45 62.48,76.71
N$11
  cutout Top: 15.24,13.46 14.99,13.46 14.99,13.21 15.24,13.21
N$12
  Top 0.203: R9.2 58.8,81.79 59.07,81.52 U6.4
N$13
  Top 0.203: U12.1 51.72,75.72 JP22.2
N$14
  Top 0.254: R22.1 60.2,83.3 U6.6
N$15
  Top 0.254: U5.10 U5.9 22.48,37.72 21.47,36.71 20.34,36.71 C39.1 19.98,36.78 C25.1 15.93,33.78 8.28,33.78 4.65,37.41 JP11.1 2.7,35.46 JP1.1
N$16  (via drill 0.2)
  Top 0.254: 55.83,67.06 R10.2 | 55.83,67.06 55.83,65.94 R14.2 | v64.9,67.06 SJ1.1 | v55.24,67.06 55.83,67.06
  Bottom 0.254: v64.9,67.06 v55.24,67.06
N$17
  cutout Top: 21.72,40.13 21.72,39.88 21.34,39.88 21.34,40.13
N$18
  Top 0.254: R15.2 R11.1 63.81,67.64 | R16.2 R14.1 54.56,67.64 55.5,68.58 62.87,68.58 63.81,67.64 | 63.81,67.64 67.18,71.02 67.18,74.68 66.67,75.19 U2.7
N$19
  Top 0.152: Q8.1
  Top 0.203: 17.7,9.07 R25.2 | C26.1 19.3,9.91 | 18.29,9.91 18.29,9.85 R25.2 | R25.2 17.7,9.07 | 17.7,9.07 17.27,8.64 15.88,8.64 15.58,8.93 Q8.1
  Top 0.254: JP15.1 2.7,15.14 JP4.1
  Top 0.813: 19.3,9.91 18.29,9.91 17.02,11.18 7.11,11.18 6.1,12.19 6.1,15.49 JP15.1
N$21  (via drill 0.2)
  Top 0.152: Q8.6
  Top 0.203: v15.49,7.87 14.73,8.64 Q8.6 | v19.02,5.54 19.7,4.87 U8.1
  Bottom 0.203: v15.49,7.87 17.82,5.54 v19.02,5.54
N$22  (via drill 0.2)
  Top 0.203: Q8.3 15.66,10.41 v16.51,10.41
  Top 0.254: U11.5 13.72,1.91 14.73,2.92 v14.73,7.87
  Bottom 0.254: v14.73,7.87 14.73,8.64 v16.51,10.41
N$23
  Top 0.203: U3.VCC 15.31,21.74 17.55,21.74 17.57,21.72 22.51,21.72 23.88,23.08 23.88,27.05 23.37,27.56 22.83,27.56 22.38,27.11 Q10.6
N$24
  Top 0.152: Q10.1 22.39,23.58 R27.2
  Top 0.203: Q10.1 21.52,25.98 15.24,32.26
  Top 0.254: JP8.1 2.7,30.38 JP14.1 15.24,32.26
N$25
  Top 0.254: U1.14 13.09,38.98 12.7,39.37 12.7,40.97 C12.1
N$26
  Top 0.254: U1.16 12.43,37.98 11.54,37.1 | 11.54,37.1 X4.1 | C42.1 11.61,37.03 11.54,37.1
N$27
  Top 0.254: U1.15 12.42,38.48 X4.2 11.61,39.65 C43.1
N$29  (via drill 0.2)
  other vias: 19.81,47.62
N$30
  Top 0.254: U2.4 64.89,72.96 C17.1
N$31
  Top 0.152: Q7.6 14.81,19.18
  Top 0.254: U4.1 17.18,13.55 14.81,15.92 14.81,16.76 | 14.81,16.76 14.81,19.18 | R4.2 14.81,16.76
N$32
  Top 0.254: SJ1.2 67.18,65.53 67.69,66.04 67.69,75.18 67.18,75.69 U2.8
N$33
  Top 0.203: Q7.1 16.84,18.03 17.53,18.03 17.96,18.47 R23.2 18.67,19.51 18.67,19.68 | C24.1 19.3,19.23 19.3,19.56 | C31.1 20.32,19.56
  Top 0.254: JP2.1 2.7,25.3 JP12.1
  Top 0.813: JP12.1 10.67,21.08 17.27,21.08 18.67,19.68 18.8,19.56 19.3,19.56 20.32,19.56
N$34
  Top 0.203: Q1.6 19.76,7.24 21.21,7.24 22.61,5.84 22.61,1.81 U8.3
N$35
  cutout Route15: 0,67.82 6.1,67.82 6.1,72.9 0,72.9
N$36
  Top 0.203: 13.13,10.34 13.46,10.16 13.65,10.34 Q8.4
  Top 0.254: JP5.1 2.7,10.06 JP16.1 | C27.1 11.68,10.16 | R26.2 12.95,10.16
  Top 0.813: JP16.1 6.35,10.16 11.68,10.16 12.95,10.16 13.46,10.16
N$37
  Top 0.152: Q7.4 13.05,19.91 12.45,19.3
  Top 0.254: JP3.1 2.7,20.22 JP13.1 | R24.2 12.45,18.87 12.45,19.3 | C32.1 11.68,19.3
  Top 0.813: 12.45,19.3 11.68,19.3 9.14,19.3 7.37,19.3 JP13.1
N$38
  cutout Top: 0,72.9 6.1,72.9 6.1,71.63 10.29,71.63 10.29,70.61 9.91,70.63 9.14,70.61 9.01,70.52 9.01,70.15 6.1,70.1 6.1,67.82 2.29,67.82 2.29,68.83 0.76,68.83 0.76,67.82 0,67.82
  cutout Top: 0,57.53 6.1,57.53 6.1,56.77 9.91,56.77 9.91,55.24 6.1,55.24 6.1,52.45 2.29,52.45 2.29,53.47 0.76,53.47 0.76,52.45 0,52.45
  cutout Bottom: 0,57.53 6.1,57.53 6.1,56.77 9.91,56.77 9.91,55.24 6.1,55.24 6.1,52.45 2.29,52.45 2.29,53.47 0.76,53.47 0.76,52.45 0,52.45
  cutout Route2: 0,57.53 6.1,57.53 6.1,56.77 9.91,56.77 9.91,55.24 6.1,55.24 6.1,52.45 2.29,52.45 2.29,53.47 0.76,53.47 0.76,52.45 0,52.45
  cutout Route15: 0,57.53 6.1,57.53 6.1,56.77 9.91,56.77 9.91,55.24 6.1,55.24 6.1,52.45 2.29,52.45 2.29,53.47 0.76,53.47 0.76,52.45 0,52.45
N$39
  cutout Bottom: 0,67.82 6.1,67.82 6.1,72.9 0,72.9
N$40
  Top 0.254: U2.20 61.36,74.69 61.34,74.68
  Top 0.508: 61.34,74.68 59.11,74.68 L7.P$1
N$41
  Top 0.203: Q1.3 18.37,1.44 19.05,0.76 19.56,0.76 U8.2
N$42
  Top 0.254: JP6.1 2.7,40.54 JP10.1 5.71,43.56 12.32,43.56 12.57,43.31 12.57,42.16 12.88,41.86 C33.1 13.34,39.61 U1.13
N$43
  cutout Top: 8.13,0 8.13,5.08 24.64,5.08 24.64,0
  cutout Bottom: 8.13,0 8.13,5.08 24.64,5.08 24.64,0
  cutout Route2: 8.13,0 8.13,5.08 24.64,5.08 24.64,0
  cutout Route15: 8.13,0 8.13,5.08 24.64,5.08 24.64,0
N$44
  Top 0.254: U10.B3 15.33,68.27 L6.2
N$45
  Top 0.203: Q5.1 64.22,85.52 64.14,85.6 63.37,85.6 63.12,85.34 63.12,84.07 63.37,83.82 64.9,83.82 65.07,83.99 Q5.4
N$46  (via drill 0.2)
  Top 0.254: U12.18 44.88,80.95 44.57,80.95 44.2,81.32 v44.2,81.79 | v43.05,81.79 42.45,81.79 JP17.1
  Bottom 0.254: v44.2,81.79 v43.05,81.79
N$47  (via drill 0.2)
  Top 0.203: Q5.6 65.07,86.02 v65.15,86.11
  Top 0.254: U2.3 64.39,72.52 v64.64,72.26 | U2.19 61.86,75.19 v61.85,75.18
  Bottom 0.61: 61.85,75.06 v61.85,75.18
  Bottom 0.813: v65.15,86.11 62.87,86.11 60.58,83.82 60.58,76.45 v61.85,75.18 64.64,72.39 v64.64,72.26
N$48
  Top 0.203: U11.1 10.74,2.97 8.97,4.74 Q2.3
N$49
  Top 0.254: 15.93,66.22 L6.1
  Top 0.508: L3.2 15.93,66.22
N$50
  Top 0.203: Q2.6 10.11,6.73 10.55,6.73 13.64,3.64 U11.6
N$51
  Top 0.152: Q3.3
  Top 0.203: Q3.3 9.35,12.62 9.53,12.45 13.16,12.45 U7.6
N$52
  Top 0.203: Q3.6 10.36,13.97 11.94,13.97 12.95,12.95 U7.5
N$53
  Top 0.203: Q6.4 65.07,80.44 64.64,80.01 63.37,80.01 63.12,80.26 63.12,81.53 63.37,81.79 64.06,81.79 Q6.1
N$54
  Top 0.152: Q4.3 17.9,14.6 17.9,12.07 18.03,11.94 18.45,11.94 U4.4
N$55
  Top 0.152: Q4.6 18.59,15.54 18.92,15.88 19.43,15.88 19.68,15.62 19.68,13.97 18.66,12.95 U4.6
N$56  (via drill 0.2)
  Top 0.254: JP18.1 54.58,38.2 55.75,39.37 JP19.1 | U1.5 16.64,37.61 v16.64,36.32
  Bottom 0.254: 57.53,38.86 JP19.1 56.77,38.1 34.42,38.1 32.64,36.32 v16.64,36.32
N$57  (via drill 0.2)
  Top 0.254: 59.82,65.53 R28.1 R29.2 R13.2 R12.1 59.82,65.53 | U2.12 64.89,78.48 v64.9,78.49 | v59.82,67.56 59.82,65.53
  Bottom 0.254: v64.9,78.49 65.91,77.47 65.91,72.39 62.1,68.58 60.83,68.58 v59.82,67.56
N$58  (via drill 0.2)
  Top 0.254: R28.2 61.67,65.94 R21.1 v60.83,67.56 60.33,68.07 57.2,68.07 R10.1 56.69,65.94 R12.2 | v65.66,78.49 65.39,78.22 U2.11
  Bottom 0.254: v60.83,67.56 63.12,67.56 66.67,71.12 66.67,77.47 v65.66,78.49
N$59  (via drill 0.2)
  Top 0.152: v16.26,20.07 15.82,20.07 Q7.3
  Top 0.203: U7.1 15.1,12.3 | v16.26,13.59 14.22,15.62 R5.2
  Top 0.254: U7.1 15.61,12.3 16.26,12.95 v16.26,13.59
  Bottom 0.203: v16.26,20.07 v16.26,13.59
N$60
  Top 0.203: B2.ANT1 8.54,56.21 U9.31
N$61
  Top 0.203: B2.ANT2 8.54,55.81 U9.32
N$62
  Top 0.152: C3.1 6.6,56 6.6,56.01
  Top 0.203: 7.07,56.01 6.6,56.01
  Top 0.254: B2.SE 7.07,56.01
  Top 0.305: A1.S1 1.6,56.01 6.6,56.01
N$63
  Top 0.203: L2.2 18.07,56.69 L5.1
N$64
  Top 0.203: U9.37 10.25,53.05 10.03,52.83 8.51,52.83 8.13,52.45 8.13,51.74 X5.1 8.12,51.74 C6.1
N$65
  Top 0.203: X5.3 9.79,50.75 C7.1 10.65,50.91 10.41,51.14 10.41,52.7 10.65,52.94 U9.38
N$66
  Top 0.152: U9.39 11.05,52.32 10.79,52.07 10.79,51.31 11.3,50.8 C15.1
N$67
  Top 0.152: U9.29 8.91,57.01 8,57.91 7.42,57.91 C19.1
NRF_A2
  Top 0.152: U9.46 13.85,52.83 14.35,52.32 15.62,52.32 16,51.94 16,51.16 X2.B 16.74,51.13 C9.1
  Top 0.203: 15.94,51.23 X2.B
NRF_A3
  Top 0.152: 14.87,51.18 X2.A | 14.87,51.18 14.87,51.81 14.67,52.01 14.16,52.01 13.45,52.72 U9.45 | C8.1 14.79,51.11 14.87,51.18
PIR_OUT  (via drill 0.2)
  Top 0.152: U10.Y23 10.08,74.75 v10.22,74.9
  Top 0.203: U9.3 16.02,55.01 v16.26,55.24
  Top 0.254: v28.07,31.88 v28.07,47.24 v28.07,75.44
  Route2 0.152: v10.22,74.9 10.76,75.44 v28.07,75.44
  Bottom 0.152: v16.26,55.24 16.51,54.99 19.07,54.99 19.51,55.42 19.86,55.42 20.11,55.18 20.13,55.18 v28.07,47.24
  Bottom 0.254: J2.14 28.32,31.62 v28.07,31.88 21.06,24.87 U3.OUT
RTC_CS  (via drill 0.2)
  Top 0.152: U10.AD10 13.59,75.41 13.59,76.33 15.37,78.11 17.91,78.11 19.3,76.71 v19.3,74.55 | U9.41 11.85,51.4 12.32,50.93 12.32,48.9 v15.62,45.59
  Top 0.254: v23.5,70.36 v23.5,50.55 23.5,46.74 20.83,44.07 16,44.07 v15.62,43.69 14.11,42.18 U1.12
  Route2 0.254: v23.5,50.55 24.64,51.69 29.84,51.69 31.24,50.29 63.63,50.29 J3.2
  Bottom 0.152: v19.3,74.55 v23.5,70.36
  Bottom 0.254: v15.62,45.59 v15.62,43.69
RXD  (via drill 0.2)
  Top 0.254: JP21.1 48.36,76.04 v48.77,76.45 | U12.2 50.06,78.38 v50.42,78.74
  Bottom 0.254: v50.42,78.74 50.42,78.11 v48.77,76.45
SCK  (via drill 0.2)
  Top 0.152: U10.AD18 11.58,76.07 11.05,76.6 11.05,78.13 v11.54,78.63 | U9.19 12.25,60.89 14.73,63.37 21.84,63.37 v21.97,63.25
  Top 0.254: U5.1 23.74,40.76 v23.75,40.77 | v17.02,38.99 U1.7 | v34.16,63.88 v34.16,58.93 v34.16,40.77 34.16,21.97 34.67,21.46 J2.6
  Bottom 0.152: v11.54,78.63 11.72,78.63 11.76,78.66 17.86,78.66 32.51,64.01 33.02,64.01 33.15,64.14 33.88,64.14 34.01,64.01 v34.16,63.88 | 31.62,61.47 31.75,61.34
  Bottom 0.254: v34.16,40.77 v23.75,40.77 18.8,40.77 v17.02,38.99 | v21.97,63.25 29.84,63.25 31.75,61.34 v34.16,58.93
SCL  (via drill 0.2)
  Top 0.152: U9.16 13.45,60.56 15.11,62.23 20.7,62.23 21.21,61.72 v21.72,61.72 | U10.N1 16.27,72.4 17.53,73.66 18.54,73.66 21.72,70.48 21.72,64.26 v21.21,63.88 | Q4.1 | v8.76,14.1 9.07,14.1 Q3.1
  Top 0.203: Q2.1 8.89,6.53 8.89,7.11 9.14,7.37 v13.97,7.37 | Q1.1 18.37,7.2 v18.8,7.62 | Q4.1 17.45,15.75 v15.75,15.75
  Top 0.254: v32.64,58.17 v32.64,20.32 36.58,16.38 J2.2 | R2.1 25.48,16.31 25.91,15.88 v27.05,15.88
  Route2 0.152: v21.21,63.88 21.21,62.23 v21.72,61.72
  Route2 0.203: v18.8,7.62 18.54,7.37 v13.97,7.37
  Route2 0.254: v15.75,15.75 18.8,15.75 18.92,15.88 v27.05,15.88
  Bottom 0.203: v32.64,20.32 32,20.32 31.95,20.27 31.94,20.27 31.67,20 31.67,19.99 v27.05,15.88 v18.8,7.62 | v8.76,14.1 8.51,14.1 8.13,13.72 8.13,13.34 9.02,12.45 10.67,12.45 13.97,15.75 v15.75,15.75
  Bottom 0.254: v21.72,61.72 29.08,61.72 v32.64,58.17
SDA  (via drill 0.2)
  Top 0.152: U10.L1 16.28,71.9 17.65,73.28 18.41,73.28 21.34,70.36 21.34,64.64 v21.21,64.64 | U9.14 14.25,60.35 15.11,61.21 v21.97,61.21 | Q4.4 19.15,14.76 v19.18,14.73 | Q1.4 | Q3.4
  Top 0.203: v12.19,12.95 10.36,12.95 Q3.4 | Q2.4 9.82,5.67 v10.41,5.08 | v20.07,5.59 19.76,5.89 19.75,5.89 19.65,5.99 Q1.4
  Top 0.254: v32.13,57.91 v32.13,19.81 36.83,15.11 73.41,15.11 J2.1 | R3.1 28.37,16.43 v26.67,14.73
  Route2 0.152: v21.21,64.64 21.84,64.64 22.48,64.01 22.48,61.72 v21.97,61.21
  Route2 0.254: v19.18,14.73 v26.67,14.73
  Bottom 0.203: v10.41,5.08 19.56,5.08 v20.07,5.59 20.57,6.1 20.57,8.64 v26.67,14.73 32.13,19.68 v32.13,19.81
  Bottom 0.254: v21.97,61.21 28.83,61.21 v32.13,57.91 | v12.19,12.95 17.4,12.95 v19.18,14.73
SW  (via drill 0.2)
  Top 0.152: U9.8 16.24,57.01 v16.38,57.15 | U10.G1 16.2,71.02 16.34,71.02 17.52,72.21 v18.16,72.21
  Top 0.254: 62.1,59.44 61.98,59.44 | 61.98,59.44 v55.5,59.44 | v54.48,76.07 56.26,77.85 56.26,78.36 | 61.98,59.44 62.87,59.44 72.14,50.16 J3.8
  Route15 0.254: v18.16,72.21 24.84,72.21 26.29,73.66 v35.31,73.66 | v16.38,57.15 17.53,58.29 21.08,58.29 25.91,63.12 v35.31,63.12 | v55.5,59.44 54.48,60.45 v54.48,76.07
  Bottom 0.254: v35.31,63.12 v35.31,73.66 41.27,73.66 48.39,80.77 v56.13,80.77
  pour Top (isolate 0.203, no thermals): 58.29,82.3 55.5,82.3 55.5,77.72 57.02,77.72 57.02,82.04 58.29,82.04
SWDCLK  (via drill 0.2)
  Top 0.102: J1.4 24.26,83.08 25.16,82.17 25.16,80.89 24.15,79.88 22.99,79.88 v21.59,81.28 | U10.AA24 9.54,74.44 8.26,75.72 8.26,78.02 12.53,82.3 v20.57,82.3
  Top 0.152: U9.24 10.25,60.54 R8.1 9.51,61.21 v8.76,61.21 | v8.95,74.36 9.46,74.36 9.54,74.44
  Route15 0.152: v8.95,74.36 9.02,74.42 11.18,74.42 11.68,73.91 11.68,65.41 8.76,62.48 v8.76,61.21
  Bottom 0.102: v21.59,81.28 v20.57,82.3
SWDIO  (via drill 0.2)
  Top 0.102: J1.6 22.58,83.03 22.58,82.7 v21.88,82 21.67,81.79 12.38,81.79 8.51,77.92 8.51,76.07 | J1.2 25.4,83.31 v25.4,82.68 | U10.AC24 8.51,75.97 8.51,76.07 | v9.02,76.07 8.51,76.07
  Top 0.152: U9.23 10.65,61.29 R1.2 10.21,62.66 v10.41,62.87 | 8.53,76.07 v9.02,76.07
  Route15 0.152: v10.41,62.87 12.01,64.47 12.01,66.47 12.83,67.29 12.83,74.17 10.92,76.07 v9.02,76.07
  Bottom 0.102: v25.4,82.68 24.66,82.68 24.26,83.08 22.96,83.08 v21.88,82
TXD
  Top 0.254: U12.30 48.01,76.96 46.99,75.95 46.35,75.95 45.72,75.31 45.72,74.9 JP20.1
USB_5V
  Top 0.254: U12.19 44.46,80.38 43.69,81.15 43.69,83.57 44.32,84.2 44.83,84.2 45.07,84.44 J5.1
VBAT  (via drill 0.2, 0.41)
  Top 0.152: U10.J1 16.28,71.4 17.65,72.77 v18.16,72.77 | U9.6 16.82,56.21 v16.89,56.13
  Top 0.203: Q6.6 65.07,81.66
  Top 0.254: U2.14 63.89,78.22 v63.37,78.74 | v64.9,82.8 65.07,82.63 65.07,81.66 | JP19.2 55.53,36.83 JP18.2
  Route15 0.254: v18.16,72.77 24.77,72.77 26.92,74.93 34.8,74.93 42.39,67.34 | v16.89,56.13 17.04,56.29 17.09,56.29 18.21,57.4 v29.59,57.4 | v63.37,78.74 64.9,80.26 v64.9,82.8 | J3.6 49.02,46.86 48.26,46.1 | v42.67,57.4 41.75,58.33 41.75,58.39 | 48.39,36.07 48.26,35.94 49.15,36.83 JP19.2
  Route15 1.27: v63.37,78.74 53.79,78.74 42.39,67.34 BT4.+
  Route15 2.54: 48.26,10.03 48.26,35.94 48.26,46.1 48.26,51.88 41.75,58.39 BT4.+
  Bottom 0.254: v29.59,57.4 v42.67,57.4
  pour Route15: 25.4,7.37 71.12,7.37 71.12,12.7 25.4,12.7
VCC  (via drill 0.2, 0.41)
  Top 0.102: J1.1 26.21,84.71 26.44,84.94 27.79,84.94 v27.81,84.96
  Top 0.152: JP7.2 1.52,44.52 | 26.41,16.95 R2.2
  Top 0.203: JP22.1 50.9,73.63 v50.8,73.53
  Top 0.254: JP4.2 1.68,14.48 JP15.2 | JP5.2 4.41,9.24 JP16.2 | JP8.2 4.41,29.56 JP14.2 | JP2.2 4.41,24.48 JP12.2 | JP3.2 4.41,19.4 JP13.2 | JP1.2 4.41,34.64 JP11.2 | R7.2 9.53,34.8 4.57,39.75 JP10.2 1.68,39.88 JP6.2 | R6.2 30.94,83.89 v30.99,83.95 | R2.2 26.87,17.02 | 26.87,17.02 R3.2 | 26.87,17.02 26.87,17.7 v26.67,17.91
  Top 1.27: JP9.2 2.92,44.96 2.48,44.52 1.52,44.52
  other vias: 57.02,84.33 56.01,83.31
  pour Top (isolate 0.203, no thermals): 58.04,83.82 58.04,82.8 55.5,82.8 55.5,84.84 57.53,84.84 57.53,83.82
  pour Route15 (rank 2): 0,89.41 79.25,89.41 79.25,0 0,0
VCC_JUMP  (via drill 0.2)
  Top 0.152: C20.1 9.7,76.37 | 1.52,45.94 JP7.1
  Top 0.203: C23.1 10.58,67.47 v10.58,67.96 v10.57,67.96 10.57,68.89 U10.A22 | v11.96,76.85 12.4,76.42 C21.1 U10.AD14 | v9.02,76.85 9.45,76.42 C20.1 9.65,75.83 U10.AD23 | 15.55,58.61 U9.12 15.58,58.61 15.96,58.99 C28.1 | U9.1 15.9,54.21 v16.26,53.85 16.57,54.17 C36.1 16.9,54.21 | 16.02,74.07 v16.89,74.95 | 16.02,74.07 15.91,74.07 15.83,74.15 U10.Y2 | U10.W1 16.02,73.96 16.02,74.07
  Top 0.254: C29.1 16.89,68.09 16.76,68.22 | 16.76,68.22 16.08,68.9 U10.B1 | 16.76,68.22 v16.76,68.98 | C28.1 16.43,59.23 v16.76,59.56
  Top 0.305: v16.89,74.95 16.89,76.53 C35.1
  Top 1.27: JP9.1 3.45,46.38 2.33,46.38 1.9,45.94 1.52,45.94
  Route2 0.813: v16.76,59.56 v16.76,68.98
  Route15 0.813: JP9.1 9.65,52.58 10.92,52.58 12.19,53.85 v16.26,53.85
  Bottom 0.203: v16.26,53.85 15.11,54.99 15.11,57.91 v16.76,59.56
  Bottom 0.508: v9.02,76.85 v11.96,76.85 14.99,76.85 v16.89,74.95 17.14,74.69 17.14,69.36 v16.76,68.98 15.75,67.96 v10.57,67.96
VDD_PA1
  Top 0.203: U9.30 8.8,56.61 8.36,57.05 C16.1 7.92,57.02 B2.VCC
VSEC  (via drill 0.2)
  Top 0.152: U9.5 16.58,55.81 v16.89,55.5 | U10.A12 13.08,68.7 12.45,68.07 v12.45,66.29
  Top 0.254: 60.33,76.2 60.83,75.69 U2.18 | v35.2,55.5 50.55,55.5 55.5,60.45 | J3.5 76.45,48.64 76.45,60.07 70.55,65.98
  Top 0.813: 60.33,76.2 57.02,76.2 53.21,72.39 53.21,62.74 55.5,60.45 65.02,60.45 70.55,65.98 71.29,66.72 71.29,70.1 | 71.29,70.1 BT1.+ | 71.31,70.08 71.29,70.1
  Route15 0.254: v35.2,55.5 | v16.89,55.5 v35.2,55.5 | v35.2,55.5 35.92,56.21 35.92,64.16 33.78,66.29 v12.45,66.29
  Route15 0.813: BT5.+ 71.29,66.01 BT1.+
VSOL  (via drill 0.2, 0.41)
  Top 0.152: U9.7 16.73,56.61 v16.89,56.77 | U10.A10 13.46,68.78 13.46,68.65 12.95,68.15 12.95,66.17 v12.45,65.66
  Top 0.254: J3.7 75.95,50.67 75.95,58.42 D1.1
  Top 0.406: U2.2 63.89,72.27 63.88,72.26
  Route15 0.254: v16.89,56.77 17.93,57.81 28.6,57.81 32.13,61.34 33.15,61.34 33.27,61.21 | v33.27,63.63 32,63.63 29.97,65.66 v12.45,65.66 | 33.27,61.21 v35.31,59.18 | v33.27,62.48 33.27,61.21
  Bottom 0.254: v33.27,62.48 v33.27,63.63 | v35.31,59.18 51.94,59.18 54.36,61.59
  Bottom 0.813: v61.59,71.37 56.26,71.37 53.21,68.33 53.21,62.74 54.36,61.59 55.5,60.45 73.91,60.45 D1.1
  pour Top (no thermals): 57.28,72.52 57.28,69.98 61.85,69.98 62.87,70.99 64.14,70.99 64.14,72.52
VSW  (via drill 0.2, 0.41)
  Top 0.203: Q6.3 64.04,80.93 v63.63,80.52 | Q5.3 64.04,84.74 v63.63,84.33 | R22.2 61.45,87.12 TP10.TESTPOINT
  Top 0.254: C37.1 60.55,85.99 R22.2
  Bottom 0.813: v63.63,84.33 v61.59,82.3 v61.59,80.52 v63.63,80.52
  pour Top (isolate 0.203, no thermals): 59.31,82.3 61.09,82.3 61.09,84.84 62.36,84.84 62.36,78.49 61.59,77.72 60.33,77.72 60.33,82.04 59.31,82.04
WDI  (via drill 0.2)
  Top 0.152: v11.3,51.69 11.45,51.83 U9.40 | U10.A8 14.08,68.69 13.34,67.94 13.34,65.28 14.1,64.52 20.07,64.52 v20.57,65.02
  Top 0.254: U1.2 14.61,36.33 v14.1,35.81 | v11.43,44.58 20.7,44.58 22.99,46.86 v22.99,51.05 v22.99,63.75
  Route2 0.254: v22.99,51.05 24.51,52.58 61.98,52.58 71.5,43.05 73.41,43.05 J3.3
  Bottom 0.152: v22.99,63.75 21.46,65.02 21.21,65.28 20.83,65.28 v20.57,65.02
  Bottom 0.254: v14.1,35.81 13.97,35.81 11.43,38.35 v11.43,44.58 11.43,51.56 v11.3,51.69
XL1
  Top 0.102: U10.D2 15.7,70.15 15.8,70.25 16.76,70.25 17.27,69.74 17.95,69.74 X3.A
  Top 0.203: C11.2 18.89,70.68 X3.A
XL2
  Top 0.102: U10.F2 15.7,70.65 15.8,70.55 17.56,70.55 X3.B
  Top 0.203: X3.B 17.73,70.62 C10.2

## Text on the board
tPlace: RTC | Accel | Occupancy | Light | Color | Humidity | Pressure
tNames: Permamote Eval / Neal Jackson / 12/17 | RESET | NRF52840 | FTDI Isolation | L | VSW | T | + | NRF51822 | GND | Current / Measure | MCU | SW | VSOL | VBAT | VSEC | !RST | WDI | RTC | RTC_CS | !RTC_I3 | RTC / BAT | !RTC_I2 | !RTC_I1 | Accel | ACC_CS | !ACC_I2 | !ACC_I1 | !PIR_EN | Occu | PIR_OUT | !LT_EN | !LT_INT | !CLR_EN | Color | !CLR_INT | !PR_EN | !HUM_EN | DBG_TX | Light | SCK | DBG_RX | MISO | MOSI | Pres | SCL | SDA | Hum